# Altium schematic sheet sram.SchDoc
size A4
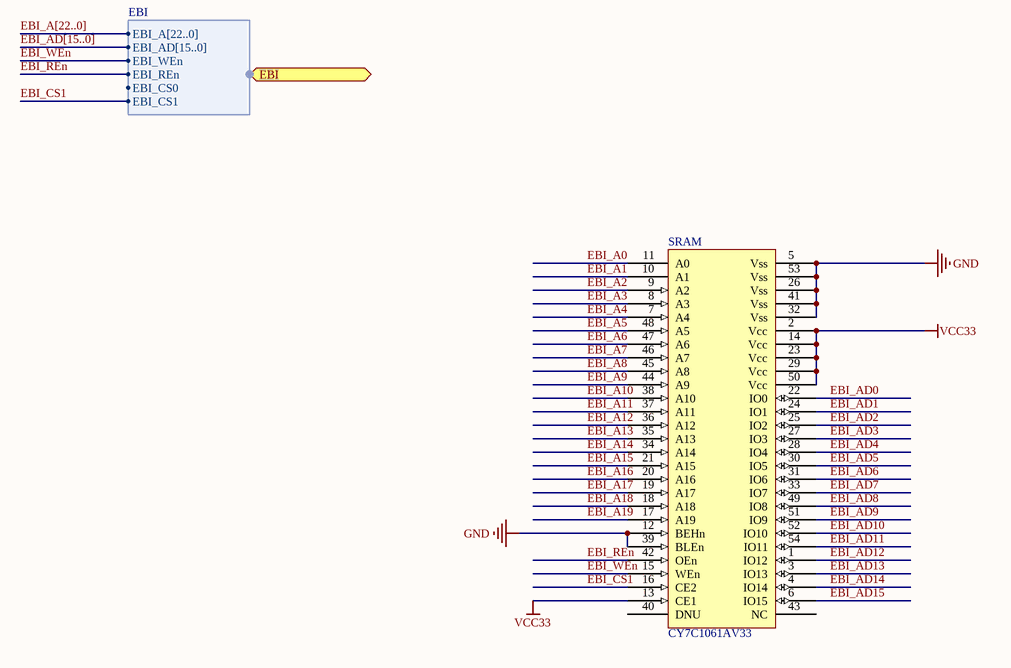
[diagram p0: sram.SchDoc]

## Parts
SRAM  CY7C1061AV33  [CY7C1061AV33]

## Ports
EBI (harness EBI)

## Harnesses
EBI: EBI_A[22..0], EBI_AD[15..0], EBI_WEn, EBI_REn, EBI_CS0, EBI_CS1

## Nets
GND: SRAM.5(Vss) SRAM.12(BEHn) SRAM.26(Vss) SRAM.32(Vss) SRAM.39(BLEn) SRAM.41(Vss) SRAM.53(Vss)
VCC33: SRAM.2(Vcc) SRAM.13(CE1) SRAM.14(Vcc) SRAM.23(Vcc) SRAM.29(Vcc) SRAM.50(Vcc)
EBI_A0: SRAM.11(A0)
EBI_A1: SRAM.10(A1)
EBI_A2: SRAM.9(A2)
EBI_A3: SRAM.8(A3)
EBI_A4: SRAM.7(A4)
EBI_A5: SRAM.48(A5)
EBI_A6: SRAM.47(A6)
EBI_A7: SRAM.46(A7)
EBI_A8: SRAM.45(A8)
EBI_A9: SRAM.44(A9)
EBI_A10: SRAM.38(A10)
EBI_A11: SRAM.37(A11)
EBI_A12: SRAM.36(A12)
EBI_A13: SRAM.35(A13)
EBI_A14: SRAM.34(A14)
EBI_A15: SRAM.21(A15)
EBI_A16: SRAM.20(A16)
EBI_A17: SRAM.19(A17)
EBI_A18: SRAM.18(A18)
EBI_A19: SRAM.17(A19)
EBI_AD0: SRAM.22(IO0)
EBI_AD1: SRAM.24(IO1)
EBI_AD2: SRAM.25(IO2)
EBI_AD3: SRAM.27(IO3)
EBI_AD4: SRAM.28(IO4)
EBI_AD5: SRAM.30(IO5)
EBI_AD6: SRAM.31(IO6)
EBI_AD7: SRAM.33(IO7)
EBI_AD8: SRAM.49(IO8)
EBI_AD9: SRAM.51(IO9)
EBI_AD10: SRAM.52(IO10)
EBI_AD11: SRAM.54(IO11)
EBI_AD12: SRAM.1(IO12)
EBI_AD13: SRAM.3(IO13)
EBI_AD14: SRAM.4(IO14)
EBI_AD15: SRAM.6(IO15)
EBI_CS1: SRAM.16(CE2) ; port EBI.EBI_CS1
EBI_REn: SRAM.42(OEn) ; port EBI.EBI_REn
EBI_WEn: SRAM.15(WEn) ; port EBI.EBI_WEn

Not connected (* = marked no-connect by the designer): SRAM 40(DNU) 43(NC)

## Buses and harness runs
bus EBI_A[22..0]
bus EBI_AD[15..0]